# Altium schematic sheet GRLV_double_Rail_v0.2b_P2.SchDoc
size A4
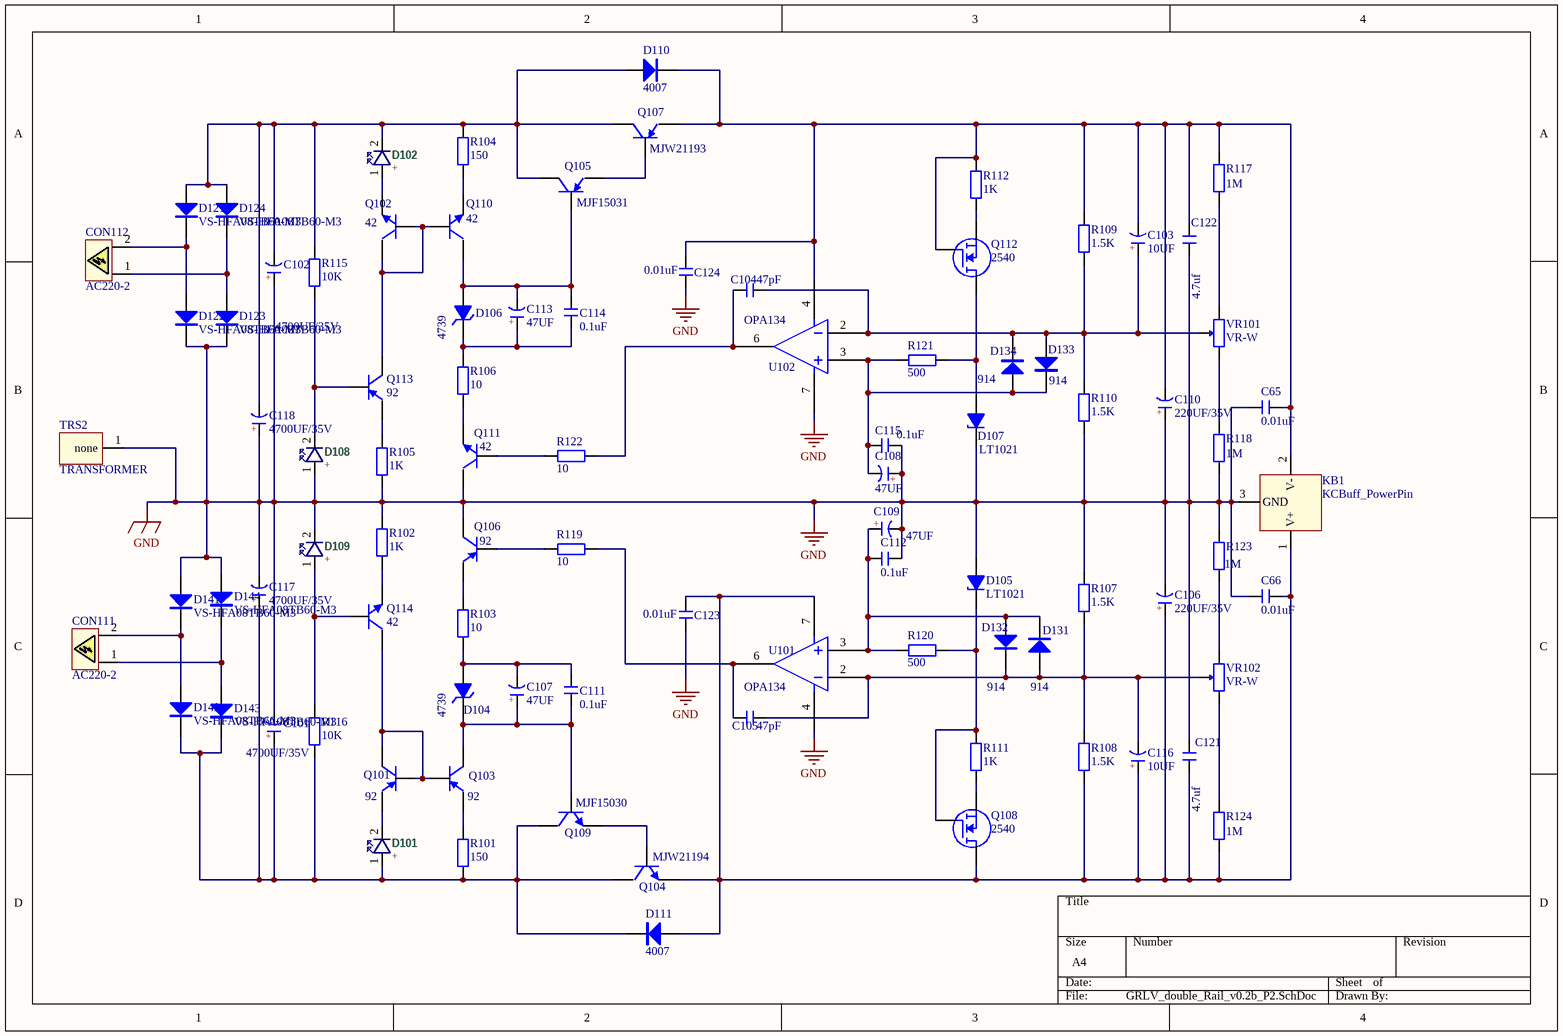
[diagram p0: GRLV_double_Rail_v0.2b_P2.SchDoc]

## Parts
C65  0.01uF  [CBB 6.3*6.3*5]
C66  0.01uF  [CBB 6.3*6.3*5]
C101  4700UF/35V  [CAP 10*22*31.5]
C102  4700UF/35V  [CAP 10*22*31.5]
C103  10UF  [CAP 2.5*6.3*7]
C104  47pF  [CBB 6.3*6.3*5]
C105  47pF  [CBB 6.3*6.3*5]
C106  220UF/35V  [CAP 5.0*10*12.5]
C107  47UF  [CAP 3.5*8*11.5]
C108  47UF  [CAP 2.5*6.3*11.2]
C109  47UF  [CAP 2.5*6.3*11.2]
C110  220UF/35V  [CAP 5.0*10*12.5]
C111  0.1uF  [CBB 6.3*6.3*5]
C112  0.1uF  [CBB 6.3*6.3*5]
C113  47UF  [CAP 3.5*8*11.5]
C114  0.1uF  [CBB 6.3*6.3*5]
C115  0.1uF  [CBB 6.3*6.3*5]
C116  10UF  [CAP 2.5*6.3*7]
C117  4700UF/35V  [CAP 10*22*31.5]
C118  4700UF/35V  [CAP 10*22*31.5]
C121  4.7uf  [CBB 7.2*7.2*13]
C122  4.7uf  [CBB 7.2*7.2*13]
C123  value 0.01uF  [CBB 6.3*6.3*5]  (hidden comment: .01)
C124  value 0.01uF  [CBB 6.3*6.3*5]  (hidden comment: .01)
CON111  AC220-2  [HX4.0-2XS]
CON112  AC220-2  [HX4.0-2XS]
D101  +  [LED 3MM-R]
D102  +  [LED 3MM-R]
D104  4739  [DO-41]
D105  LT1021  [DIP8-300_MH]
D106  4739  [DO-41]
D107  LT1021  [DIP8-300_MH]
D108  +  [LED 3MM-R]
D109  +  [LED 3MM-R]
D110  4007  [DO-41]
D111  4007  [DO-41]
D121  VS-HFA08TB60-M3  [DO-15XL]
D122  VS-HFA08TB60-M3  [DO-15XL]
D123  VS-HFA08TB60-M3  [DO-15XL]
D124  VS-HFA08TB60-M3  [DO-15XL]
D131  914  [DO-35]
D132  914  [DO-35]
D133  914  [DO-35]
D134  914  [DO-35]
D141  VS-HFA08TB60-M3  [DO-15XL]
D142  VS-HFA08TB60-M3  [DO-15XL]
D143  VS-HFA08TB60-M3  [DO-15XL]
D144  VS-HFA08TB60-M3  [DO-15XL]
KB1  KCBuff_PowerPin  [KCBuff_PowerPin_M4]
Q101  92  [TO92A]
Q102  42  [TO92A]
Q103  92  [TO92A]
Q104  MJW21194  [TO247V]
Q105  MJF15031  [TO220V]
Q106  92  [TO92A]
Q107  MJW21193  [TO247V]
Q108  2540  [TO92A]
Q109  MJF15030  [TO220V]
Q110  42  [TO92A]
Q111  42  [TO92A]
Q112  2540  [TO92A]
Q113  92  [TO92A]
Q114  42  [TO92A]
R101  150  [RS 1/4W]
R102  1K  [RS 1/4W]
R103  10  [RS 1/4W]
R104  150  [RS 1/4W]
R105  1K  [RS 1/4W]
R106  10  [RS 1/4W]
R107  1.5K  [RS 1/4W]
R108  1.5K  [RS 1/4W]
R109  1.5K  [RS 1/4W]
R110  1.5K  [RS 1/4W]
R111  1K  [RS 1/4W]
R112  1K  [RS 1/4W]
R115  10K  [RS 1/4W]
R116  10K  [RS 1/4W]
R117  1M  [RS 1/4W]
R118  1M  [RS 1/4W]
R119  10  [RS 1/4W]
R120  500  [RS 1/4W]
R121  500  [RS 1/4W]
R122  10  [RS 1/4W]
R123  1M  [RS 1/4W]
R124  1M  [RS 1/4W]
TRS2  TRANSFORMER  [TRANS_BLOCK_30W_24v]
U101  OPA134  [DIP8-300_MH]
U102  OPA134  [DIP8-300_MH]
VR101  VR-W  [RS 1/2W-VR]
VR102  VR-W  [RS 1/2W-VR]

## Nets
GND: C65.1 C66.1 C101.2(K) C102.1(A) C106.2(K) C108.1(A) C109.2(K) C110.1(A) C112.2 C115.2 C117.2(K) C118.1(A) C121.2 C122.1 C123.1 C124.1 D105.4(A) D107.6(K) D108.1(A) D109.2(K) D122.1(Cathode) D123.1(Cathode) D141.2(Anode) D144.2(Anode) KB1.3(GND) Q106.3(C) Q111.3(C) R102.2 R105.1 R107.2 R110.1 R118.1 R123.2 TRS2.1(none) U101.4(V-) U102.7(V+)
NetC65_2: C65.2 C103.2(K) C110.2(K) C122.2 C124.2 D110.2(K) KB1.2(V-) Q107.3(E) Q112.2(G) R109.2 R112.2 R117.2 U102.4(V-)
NetC66_2: C66.2 C106.1(A) C116.1(A) C121.1 C123.2 D111.1(A) KB1.1(V+) Q104.3(E) Q108.3(D) R108.1 R124.1 U101.7(V+)
NetC101_1: C101.1(A) C117.1(A) D101.1(A) D111.2(K) D142.1(Cathode) D143.1(Cathode) Q104.2(C) Q109.2(C) R101.1 R116.1
NetC102_2: C102.2(K) C118.2(K) D102.2(K) D110.1(A) D121.2(Anode) D124.2(Anode) Q105.2(C) Q107.2(C) R104.2 R115.2
NetC103_1: C103.1(A) C104.2 D133.1(A) D134.2(K) R109.1 R110.2 U102.2(-in) VR101.3
NetC104_1: C104.1 R122.2 U102.6(out)
NetC105_1: C105.1 R119.2 U101.6(out)
NetC105_2: C105.2 C116.2(K) D131.1(A) D132.2(K) R107.1 R108.2 U101.2(-in) VR102.3
NetC107_1: C107.1(A) C111.1 D104.2(K) Q103.3(C) Q109.1(B)
NetC107_2: C107.2(K) C111.2 D104.1(A) R103.1
NetC108_2: C108.2(K) C115.1 D133.2(K) D134.1(A) R121.1 U102.3(+in)
NetC109_1: C109.1(A) C112.1 D131.2(K) D132.1(A) R120.1 U101.3(+in)
NetC113_1: C113.1(A) C114.1 D106.2(K) R106.2
NetC113_2: C113.2(K) C114.2 D106.1(A) Q105.1(B) Q110.3(C)
NetCON111_1: CON111.1(L) D143.2(Anode) D144.1(Cathode)
NetCON111_2: CON111.2(G) D141.1(Cathode) D142.2(Anode)
NetCON112_1: CON112.1(L) D123.2(Anode) D124.1(Cathode)
NetCON112_2: CON112.2(G) D121.1(Cathode) D122.2(Anode)
NetD101_2: D101.2(K) Q101.1(E)
NetD102_1: D102.1(A) Q102.1(E)
NetD105_6: D105.6(K) Q108.2(G) R111.2 R120.2
NetD107_4: D107.4(A) Q112.3(D) R121.2
NetD108_2: D108.2(K) Q113.2(B) R115.1
NetD109_1: D109.1(A) Q114.2(B) R116.2
NetQ101_2: Q101.2(B) Q101.3(C) Q103.2(B) Q114.3(C)
NetQ102_2: Q102.2(B) Q102.3(C) Q110.2(B) Q113.3(C)
NetQ103_1: Q103.1(E) R101.2
NetQ104_1: Q104.1(B) Q109.3(E)
NetQ105_3: Q105.3(E) Q107.1(B)
NetQ106_1: Q106.1(E) R103.2
NetQ106_2: Q106.2(B) R119.1
NetQ108_1: Q108.1(S) R111.1
NetQ110_1: Q110.1(E) R104.1
NetQ111_1: Q111.1(E) R106.1
NetQ111_2: Q111.2(B) R122.1
NetQ112_1: Q112.1(S) R112.1
NetQ113_1: Q113.1(E) R105.2
NetQ114_1: Q114.1(E) R102.1
NetR117_1: R117.1 VR101.2
NetR118_2: R118.2 VR101.1
NetR123_1: R123.1 VR102.2
NetR124_2: R124.2 VR102.1

## Notes on the sheet
- (in symbol C-CAP) +

## Library data of the parts
C65 C66 C104 C105 C111 C112 C114 C115 C123 C124 = C-CBB: CBB电容; 版权归属: 源创客; BOM名称: CBB电容; 学习资源: www.ooocke.com
C101-C103 C106-C110 C113 C116-C118 = C-CAP: 直插电解电容; 版权归属: 源创客; BOM名称: 直插电解电容; 学习资源: www.ooocke.com
C121 C122 = C-MKS: MKS薄膜电容
D101 D102 D108 D109 = LED: 直插式LED
D104 D106 = 1N4739: 9.1V/1W稳压管
D105 D107 = LT1021-10-2P: 10V Precision Reference 2 Pin Config
D110 D111 = 1N4007: 整流二极管; 版权归属: 源创客; BOM名称: 整流二极管; 学习资源: www.ooocke.com
D121-D124 D141-D144 = VS-HFA08TB60-M3: Ultrafast Soft Recovery Diado 8A 600V; pin to pad: 1>2 2>1
D131-D134 = 1N914: 高速开关管 1V/0.25W
KB1 = KCBuff_PowerPin: King Cello Buffer Stage
Q101 Q103 Q106 Q113 = KSP92/93: High Voltage PNP Transistor
Q102 Q110 Q111 Q114 = KSP42/43: High Voltage NPN Transistor
Q104 = MJW21194: Power NPN Transistor
Q105 = MJF15031: Power PNP Transistor
Q107 = MJW21193: Power PNP Transistor
Q108 Q112 = DN2540: N沟道耗尽型DMOS场效应管 400V/150ma
Q109 = MJF15030: Power NPN Transistor
R101-R112 R115-R124 = R-CRR: 直插色环电阻; BOM名称: 色环电阻; 版权归属: 源创客; 学习资源: www.ooocke.com
  R104: Value: 150
  R109: Value: 1.5K
  R117 R118 R123 R124: Value: 1M
U101 U102 = OPA134PA
VR101 VR102 = VR-W: 直插可调电阻-顶调